# EAGLE design uOsc_2_board_1_v2.0 (EAGLE 9.2.1)
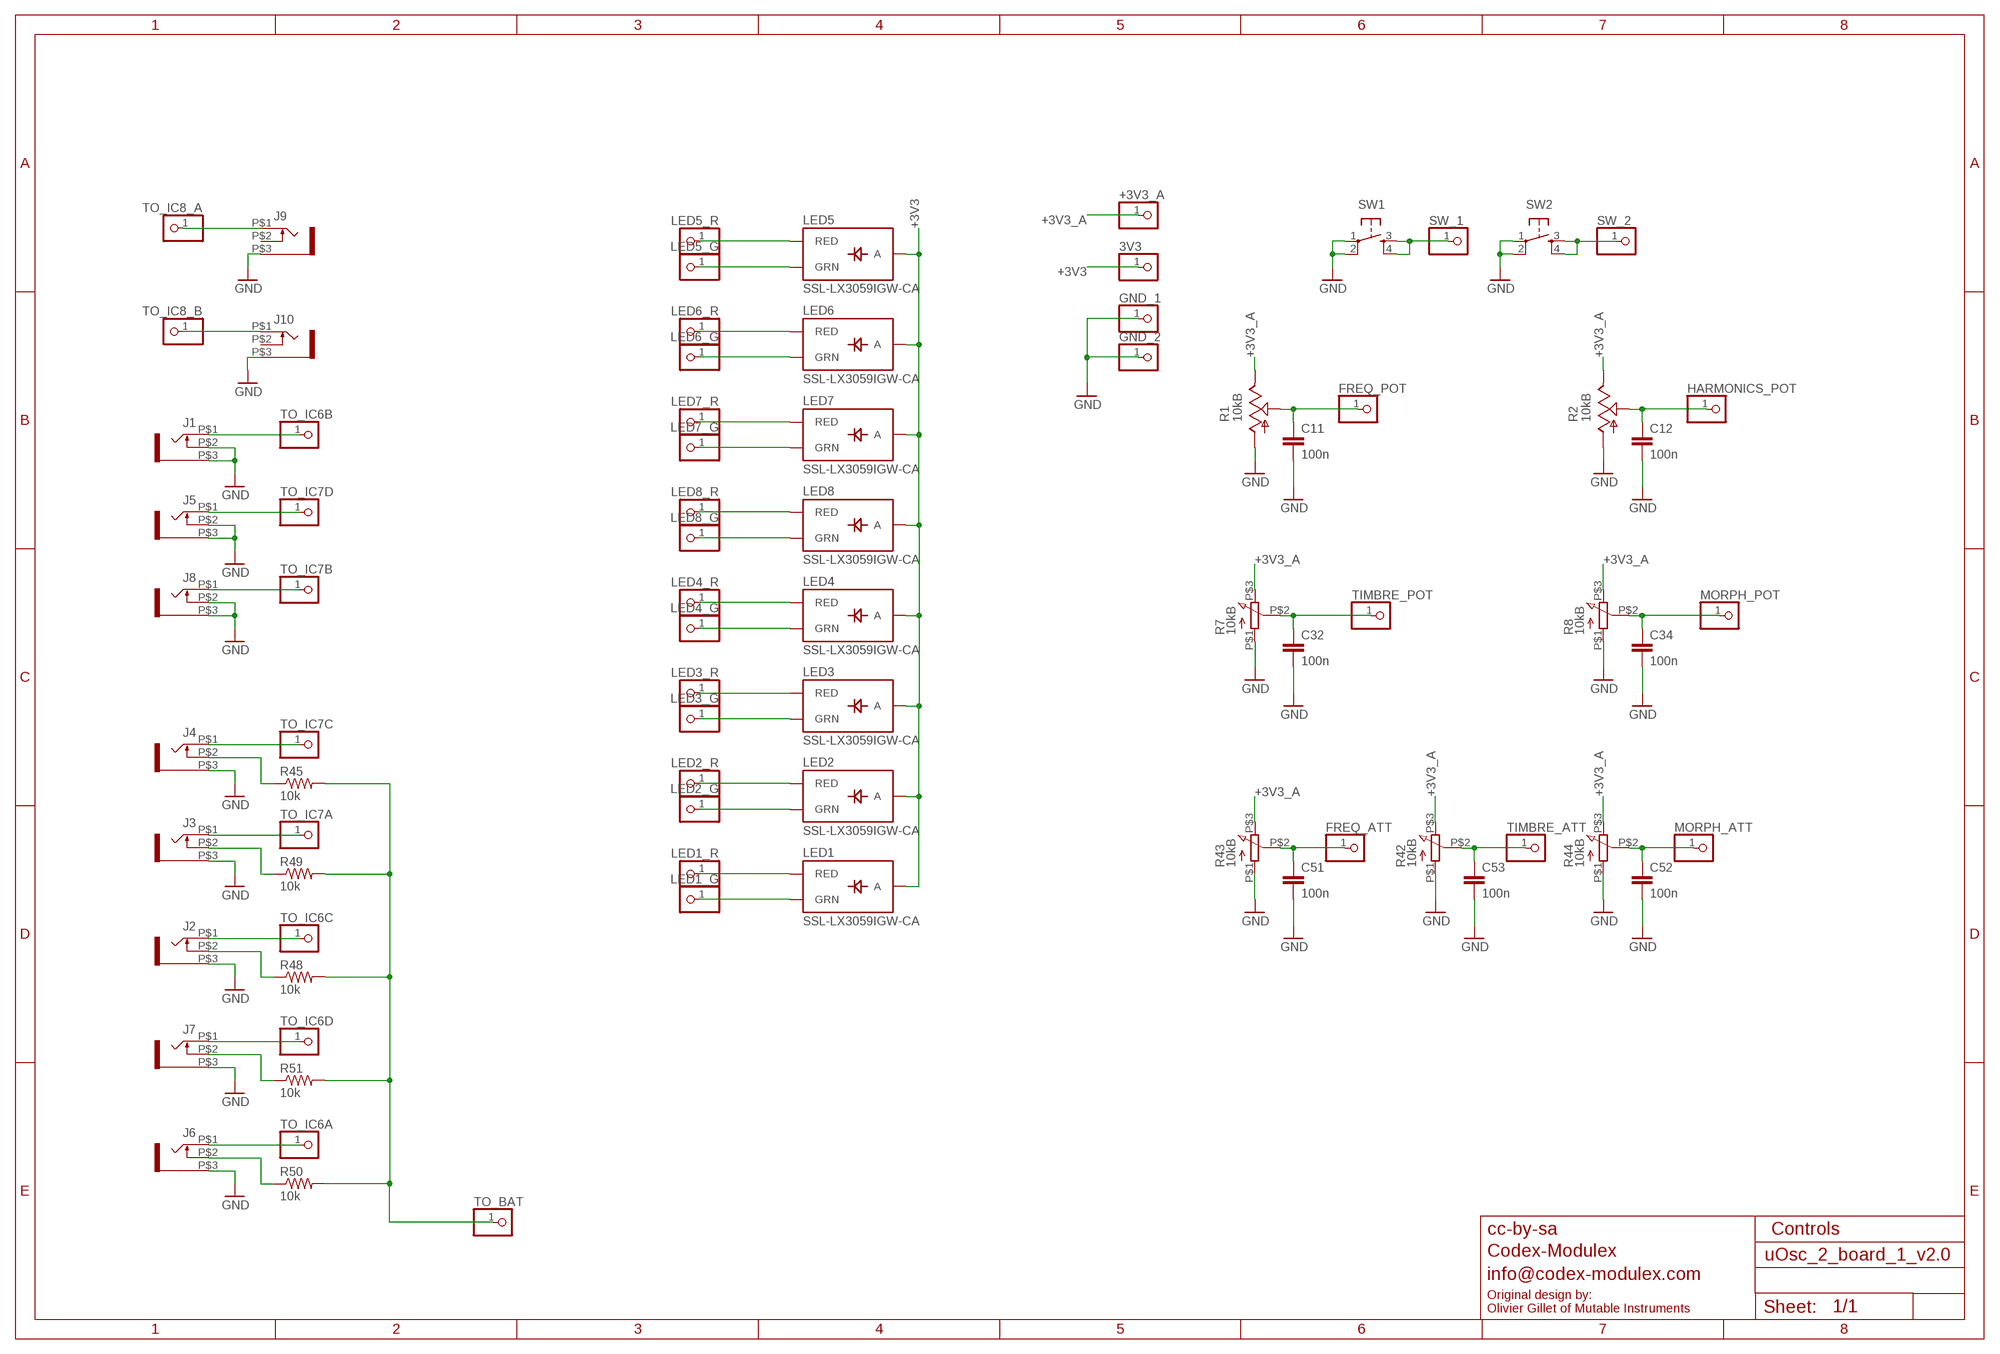
[diagram p0: schematic, sheet 1]

## Parts
3V3  PARTS_AMAN_PINHD-1X1  [PARTS_AMAN_1X01]
+3V3_A  PARTS_AMAN_PINHD-1X1  [PARTS_AMAN_1X01]
C11  100n  PARTS_AMAN_CAPACITOR  [PARTS_AMAN_RESISTOR_0603]
C12  100n  PARTS_AMAN_CAPACITOR  [PARTS_AMAN_RESISTOR_0603]
C32  100n  PARTS_AMAN_CAPACITOR  [PARTS_AMAN_RESISTOR_0603]
C34  100n  PARTS_AMAN_CAPACITOR  [PARTS_AMAN_RESISTOR_0603]
C51  100n  PARTS_AMAN_CAPACITOR  [PARTS_AMAN_RESISTOR_0603]
C52  100n  PARTS_AMAN_CAPACITOR  [PARTS_AMAN_RESISTOR_0603]
C53  100n  PARTS_AMAN_CAPACITOR  [PARTS_AMAN_RESISTOR_0603]
FREQ_ATT  PARTS_AMAN_PINHD-1X1  [PARTS_AMAN_1X01]
FREQ_POT  PARTS_AMAN_PINHD-1X1  [PARTS_AMAN_1X01]
GND_1  PARTS_AMAN_PINHD-1X1  [PARTS_AMAN_1X01]
GND_2  PARTS_AMAN_PINHD-1X1  [PARTS_AMAN_1X01]
HARMONICS_POT  PARTS_AMAN_PINHD-1X1  [PARTS_AMAN_1X01]
J1  WQP-PJ301M-12_JACK  [WQP-PJ301M-12_JACK]
J2  WQP-PJ301M-12_JACK  [WQP-PJ301M-12_JACK]
J3  WQP-PJ301M-12_JACK  [WQP-PJ301M-12_JACK]
J4  WQP-PJ301M-12_JACK  [WQP-PJ301M-12_JACK]
J5  WQP-PJ301M-12_JACK  [WQP-PJ301M-12_JACK]
J6  WQP-PJ301M-12_JACK  [WQP-PJ301M-12_JACK]
J7  WQP-PJ301M-12_JACK  [WQP-PJ301M-12_JACK]
J8  WQP-PJ301M-12_JACK  [WQP-PJ301M-12_JACK]
J9  WQP-PJ301M-12_JACK  [WQP-PJ301M-12_JACK]
J10  WQP-PJ301M-12_JACK  [WQP-PJ301M-12_JACK]
LED1  SSL-LX3059IGW-CA  LED-BICOLOR-THROUGHHOLE-CA  [LED-BICOLOR-THROUGHHOLE-LUMEX]
LED1_G  PARTS_AMAN_PINHD-1X1  [PARTS_AMAN_1X01]
LED1_R  PARTS_AMAN_PINHD-1X1  [PARTS_AMAN_1X01]
LED2  SSL-LX3059IGW-CA  LED-BICOLOR-THROUGHHOLE-CA  [LED-BICOLOR-THROUGHHOLE-LUMEX]
LED2_G  PARTS_AMAN_PINHD-1X1  [PARTS_AMAN_1X01]
LED2_R  PARTS_AMAN_PINHD-1X1  [PARTS_AMAN_1X01]
LED3  SSL-LX3059IGW-CA  LED-BICOLOR-THROUGHHOLE-CA  [LED-BICOLOR-THROUGHHOLE-LUMEX]
LED3_G  PARTS_AMAN_PINHD-1X1  [PARTS_AMAN_1X01]
LED3_R  PARTS_AMAN_PINHD-1X1  [PARTS_AMAN_1X01]
LED4  SSL-LX3059IGW-CA  LED-BICOLOR-THROUGHHOLE-CA  [LED-BICOLOR-THROUGHHOLE-LUMEX]
LED4_G  PARTS_AMAN_PINHD-1X1  [PARTS_AMAN_1X01]
LED4_R  PARTS_AMAN_PINHD-1X1  [PARTS_AMAN_1X01]
LED5  SSL-LX3059IGW-CA  LED-BICOLOR-THROUGHHOLE-CA  [LED-BICOLOR-THROUGHHOLE-LUMEX]
LED5_G  PARTS_AMAN_PINHD-1X1  [PARTS_AMAN_1X01]
LED5_R  PARTS_AMAN_PINHD-1X1  [PARTS_AMAN_1X01]
LED6  SSL-LX3059IGW-CA  LED-BICOLOR-THROUGHHOLE-CA  [LED-BICOLOR-THROUGHHOLE-LUMEX]
LED6_G  PARTS_AMAN_PINHD-1X1  [PARTS_AMAN_1X01]
LED6_R  PARTS_AMAN_PINHD-1X1  [PARTS_AMAN_1X01]
LED7  SSL-LX3059IGW-CA  LED-BICOLOR-THROUGHHOLE-CA  [LED-BICOLOR-THROUGHHOLE-LUMEX]
LED7_G  PARTS_AMAN_PINHD-1X1  [PARTS_AMAN_1X01]
LED7_R  PARTS_AMAN_PINHD-1X1  [PARTS_AMAN_1X01]
LED8  SSL-LX3059IGW-CA  LED-BICOLOR-THROUGHHOLE-CA  [LED-BICOLOR-THROUGHHOLE-LUMEX]
LED8_G  PARTS_AMAN_PINHD-1X1  [PARTS_AMAN_1X01]
LED8_R  PARTS_AMAN_PINHD-1X1  [PARTS_AMAN_1X01]
MORPH_ATT  PARTS_AMAN_PINHD-1X1  [PARTS_AMAN_1X01]
MORPH_POT  PARTS_AMAN_PINHD-1X1  [PARTS_AMAN_1X01]
R1  10kB  POT_USVERTICAL_PS  [ALPS_POT_VERTICAL_PS]
R2  10kB  POT_USVERTICAL_PS  [ALPS_POT_VERTICAL_PS]
R7  10kB  INSTRUO_Q-POT2  [INSTRUO_Q-POT2]
R8  10kB  INSTRUO_Q-POT2  [INSTRUO_Q-POT2]
R42  10kB  INSTRUO_Q-POT2  [INSTRUO_Q-POT2]
R43  10kB  INSTRUO_Q-POT2  [INSTRUO_Q-POT2]
R44  10kB  INSTRUO_Q-POT2  [INSTRUO_Q-POT2]
R45  10k  PARTS_AMAN_RESISTOR  [PARTS_AMAN_RESISTOR_0603]
R48  10k  PARTS_AMAN_RESISTOR  [PARTS_AMAN_RESISTOR_0603]
R49  10k  PARTS_AMAN_RESISTOR  [PARTS_AMAN_RESISTOR_0603]
R50  10k  PARTS_AMAN_RESISTOR  [PARTS_AMAN_RESISTOR_0603]
R51  10k  PARTS_AMAN_RESISTOR  [PARTS_AMAN_RESISTOR_0603]
SW1  TAC_SWITCHPTH  [TACTILE-PTH]
SW2  TAC_SWITCHPTH  [TACTILE-PTH]
SW_1  PARTS_AMAN_PINHD-1X1  [PARTS_AMAN_1X01]
SW_2  PARTS_AMAN_PINHD-1X1  [PARTS_AMAN_1X01]
TIMBRE_ATT  PARTS_AMAN_PINHD-1X1  [PARTS_AMAN_1X01]
TIMBRE_POT  PARTS_AMAN_PINHD-1X1  [PARTS_AMAN_1X01]
TO_BAT  PARTS_AMAN_PINHD-1X1  [PARTS_AMAN_1X01]
TO_IC6A  PARTS_AMAN_PINHD-1X1  [PARTS_AMAN_1X01]
TO_IC6B  PARTS_AMAN_PINHD-1X1  [PARTS_AMAN_1X01]
TO_IC6C  PARTS_AMAN_PINHD-1X1  [PARTS_AMAN_1X01]
TO_IC6D  PARTS_AMAN_PINHD-1X1  [PARTS_AMAN_1X01]
TO_IC7A  PARTS_AMAN_PINHD-1X1  [PARTS_AMAN_1X01]
TO_IC7B  PARTS_AMAN_PINHD-1X1  [PARTS_AMAN_1X01]
TO_IC7C  PARTS_AMAN_PINHD-1X1  [PARTS_AMAN_1X01]
TO_IC7D  PARTS_AMAN_PINHD-1X1  [PARTS_AMAN_1X01]
TO_IC8_A  PARTS_AMAN_PINHD-1X1  [PARTS_AMAN_1X01]
TO_IC8_B  PARTS_AMAN_PINHD-1X1  [PARTS_AMAN_1X01]

## Nets
+3V3: 3V3.1 LED1.A LED2.A LED3.A LED4.A LED5.A LED6.A LED7.A LED8.A
+3V3_A: +3V3_A.1 R1.P$1(E) R2.P$1(E) R7.P$3 R8.P$3 R42.P$3 R43.P$3 R44.P$3
FREQ_ATT: C51.1 FREQ_ATT.1 R43.P$2
FREQ_POT: C11.1 FREQ_POT.1 R1.P$2(S)
GND: C11.2 C12.2 C32.2 C34.2 C51.2 C52.2 C53.2 GND_1.1 GND_2.1 J1.P$2 J1.P$3 J2.P$3 J3.P$3 J4.P$3 J5.P$2 J5.P$3 J6.P$3 J7.P$3 J8.P$2 J8.P$3 J9.P$3 J10.P$3 R1.P$3(A) R2.P$3(A) R7.P$1 R8.P$1 R42.P$1 R43.P$1 R44.P$1 SW1.1 SW1.2 SW2.1 SW2.2
HARMONICS_POT: C12.1 HARMONICS_POT.1 R2.P$2(S)
MORPH_ATT: C52.1 MORPH_ATT.1 R44.P$2
MORPH_POT: C34.1 MORPH_POT.1 R8.P$2
N$1: LED1.GREEN_C(GRN) LED1_G.1
N$2: LED2.GREEN_C(GRN) LED2_G.1
N$5: LED2.RED_C(RED) LED2_R.1
N$6: J4.P$1 TO_IC7C.1
N$7: LED1.RED_C(RED) LED1_R.1
N$8: LED3.RED_C(RED) LED3_R.1
N$9: LED3.GREEN_C(GRN) LED3_G.1
N$10: LED4.RED_C(RED) LED4_R.1
N$11: LED4.GREEN_C(GRN) LED4_G.1
N$12: LED8.RED_C(RED) LED8_R.1
N$13: LED8.GREEN_C(GRN) LED8_G.1
N$14: LED7.RED_C(RED) LED7_R.1
N$15: LED7.GREEN_C(GRN) LED7_G.1
N$16: J1.P$1 TO_IC6B.1
N$17: LED6.RED_C(RED) LED6_R.1
N$18: LED6.GREEN_C(GRN) LED6_G.1
N$19: LED5.RED_C(RED) LED5_R.1
N$20: LED5.GREEN_C(GRN) LED5_G.1
N$21: J9.P$1 TO_IC8_A.1
N$22: J10.P$1 TO_IC8_B.1
N$23: J5.P$1 TO_IC7D.1
N$27: J8.P$1 TO_IC7B.1
N$29: J3.P$1 TO_IC7A.1
N$30: J2.P$1 TO_IC6C.1
N$33: J7.P$1 TO_IC6D.1
N$35: J6.P$1 TO_IC6A.1
N$37: J4.P$2 R45.1
N$38: J3.P$2 R49.1
N$40: J2.P$2 R48.1
N$41: J7.P$2 R51.1
N$42: J6.P$2 R50.1
N$43: R45.2 R48.2 R49.2 R50.2 R51.2 TO_BAT.1
SW_1: SW1.3 SW1.4 SW_1.1
SW_2: SW2.3 SW2.4 SW_2.1
TIMBRE_ATT: C53.1 R42.P$2 TIMBRE_ATT.1
TIMBRE_POT: C32.1 R7.P$2 TIMBRE_POT.1
Unconnected: J9.P$2 J10.P$2

## Notes on the sheet
- cc-by-sa | Controls
- Codex-Modulex
- info@codex-modulex.com
- Original design by:
  Olivier Gillet of Mutable Instruments

## Library data of the parts
3V3 +3V3_A FREQ_ATT FREQ_POT GND_1 GND_2 HARMONICS_POT LED1_G LED1_R LED2_G LED2_R LED3_G LED3_R LED4_G LED4_R LED5_G LED5_R LED6_G LED6_R LED7_G LED7_R LED8_G LED8_R MORPH_ATT MORPH_POT SW_1 SW_2 TIMBRE_ATT TIMBRE_POT TO_BAT TO_IC6A TO_IC6B TO_IC6C TO_IC6D TO_IC7A TO_IC7B TO_IC7C TO_IC7D TO_IC8_A TO_IC8_B = atom_v1_1_board_2:PARTS_AMAN_PINHD-1X1: PIN HEADER
C11 C12 C32 C34 C51-C53 = atom_v1_1_board_2:PARTS_AMAN_CAPACITOR
J1-J10 = thonkiconn:WQP-PJ301M-12_JACK
LED1-LED8 = og-leds:LED-BICOLOR-THROUGHHOLE-CA
R1 R2 = og-pots:POT_US
R7 R8 R42-R44 = uClouds_002_:INSTRUO_Q-POT2
R45 R48-R51 = atom_v1_1_board_2:PARTS_AMAN_RESISTOR
SW1 SW2 = SparkFun:TAC_SWITCH: Momentary Switch Button commonly used for reset or general input. Spark Fun Electronics SKU : COM-00097

## Board
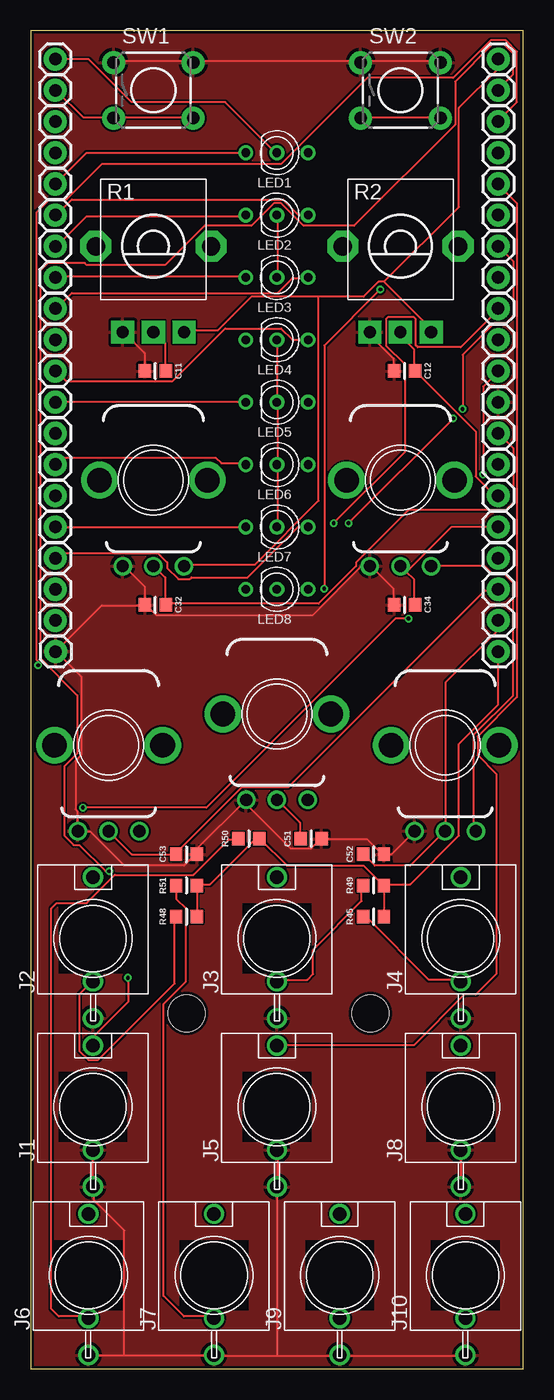
[diagram p1: board, top side]
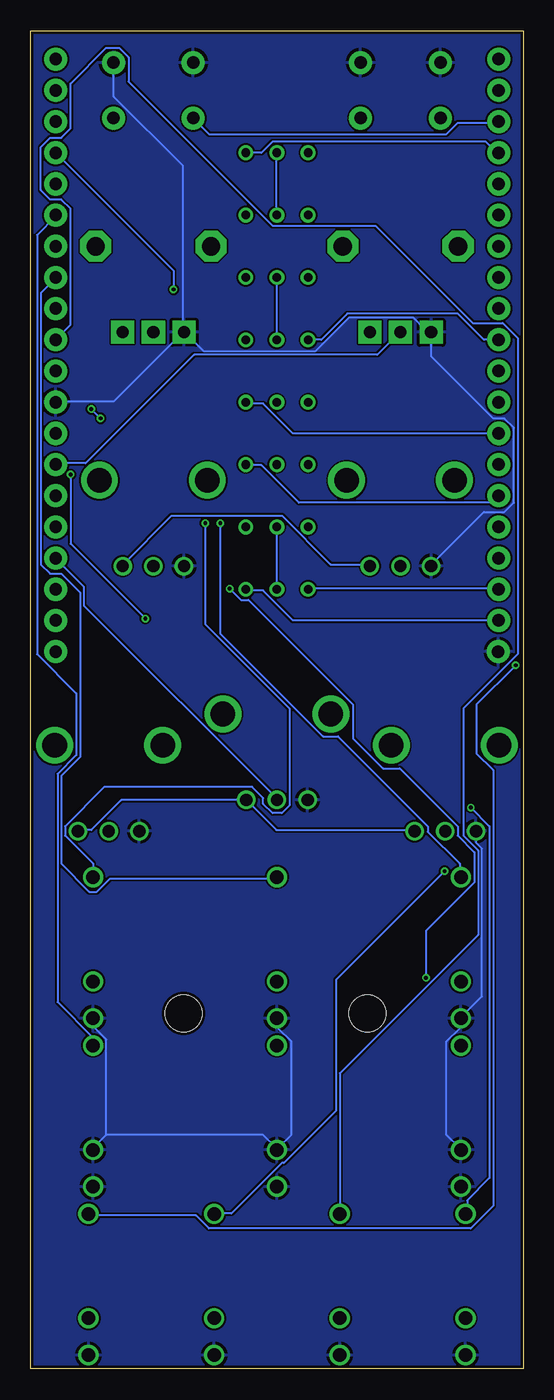
[diagram p2: board, bottom side, seen from below]

Size 40.14 x 109 mm. Coordinates in mm from the lower left corner, seen from the top.
Outline: 0,0 40.14,0 40.14,109 0,109 0,0
Copper layers (1*16): Top 0.035mm / dielectric 1.5mm / Bottom 0.035mm
Design rules "dirt_cheap_dirty_boards.v1.1": minimum track width 6mil, minimum drill 12mil, track to track 6mil, track to pad 6mil, pad to pad 6mil, via to via 6mil, smd to smd 0mil, copper to edge 10mil, drill to drill 10mil, minimum pad ring 10mil, minimum via ring 6mil, stop-mask expansion 2mil, vias tented up to drill 25mil, thermal gap 10mil
Holes 3 mm at 12.7,28.96 27.69,28.96

### Footprints (pad centres in the part's own frame; a part is rotated, then mirrored left to right if it is on the bottom)
PARTS_AMAN_1X01 = drill 1.016 pad 1.88: 1 0,0
PARTS_AMAN_RESISTOR_0603 = smd 1 x 1.1: 1 -0.85,0; 2 0.85,0
WQP-PJ301M-12_JACK = drill 1.1: P$1 0,5; P$2 0,-3.5; P$3 0,-6.5
LED-BICOLOR-THROUGHHOLE-LUMEX = drill 0.7: A 0,0; GREEN_C 2.54,0; RED_C -2.54,0
ALPS_POT_VERTICAL_PS = drill 1 pad 1.88 square: P$1 -2.5,7; P$2 0,7; P$3 2.5,7 | drill 1.5 pad 2.54 octagon: P$4 -4.7,0; P$5 4.7,0
INSTRUO_Q-POT2 = drill 1 pad 1.5: P$1 -2.5,-7; P$2 0,-7; P$3 2.5,-7 | drill 2 pad 2.5: P$4 -4.4,0; P$5 4.4,0
TACTILE-PTH = drill 1.016 pad 1.88: 1 -3.251,2.261; 2 3.251,2.261; 3 -3.251,-2.261; 4 3.251,-2.261

### Placement (x,y rotation side)
3V3  2,106.68 0 top
+3V3_A  38.1,106.68 0 top
C11  10.16,81.28 180 top
C12  30.48,81.28 180 top
C32  10.16,62.23 180 top
C34  30.48,62.23 180 top
C51  22.86,43.18 0 top
C52  27.94,41.91 0 top
C53  12.7,41.91 0 top
FREQ_ATT  38.1,66.04 0 top
FREQ_POT  38.1,73.66 0 top
GND_1  2.03,58.42 0 top
GND_2  38.1,78.74 0 top
HARMONICS_POT  38.1,71.12 0 top
J1  5.08,21.34 0 top
J2  5.08,35.05 0 top
J3  20.07,35.05 0 top
J4  35.05,35.05 0 top
J5  20.07,21.34 0 top
J6  4.7,7.62 0 top
J7  14.94,7.62 0 top
J8  35.05,21.34 0 top
J9  25.19,7.62 0 top
J10  35.43,7.62 0 top
LED1  20.07,99.06 0 top
LED1_G  2,99.06 0 top
LED1_R  2,96.52 0 top
LED2  20.07,93.98 0 top
LED2_G  2,93.98 0 top
LED2_R  2,91.44 0 top
LED3  20.07,88.9 0 top
LED3_G  2,86.36 0 top
LED3_R  2,88.9 0 top
LED4  20.07,83.82 0 top
LED4_G  2,81.28 0 top
LED4_R  2,83.82 0 top
LED5  20.07,78.74 0 top
LED5_G  2,76.2 0 top
LED5_R  2,78.74 0 top
LED6  20.07,73.66 0 top
LED6_G  2,71.12 0 top
LED6_R  2,73.66 0 top
LED7  20.07,68.58 0 top
LED7_G  2,66.04 0 top
LED7_R  2,68.58 0 top
LED8  20.07,63.5 0 top
LED8_G  2,60.96 0 top
LED8_R  2,63.5 0 top
MORPH_ATT  38.1,60.96 0 top
MORPH_POT  38.1,68.58 0 top
R1  10,91.44 180 top
R2  30.14,91.44 180 top
R7  10,72.39 0 top
R8  30.14,72.39 0 top
R42  6.35,50.8 0 top
R43  20.07,53.34 0 top
R44  33.78,50.8 0 top
R45  27.94,36.83 0 top
R48  12.7,36.83 0 top
R49  27.94,39.37 0 top
R50  17.78,43.18 0 top
R51  12.7,39.37 0 top
SW1  10,104.14 0 top
SW2  30.14,104.14 0 top
SW_1  2,104.14 0 top
SW_2  2,101.6 0 top
TIMBRE_ATT  38.1,63.5 0 top
TIMBRE_POT  38.1,76.2 0 top
TO_BAT  38.1,58.42 0 top
TO_IC6A  38.1,81.28 0 top
TO_IC6B  38.1,99.06 0 top
TO_IC6C  38.1,86.36 0 top
TO_IC6D  38.1,83.82 0 top
TO_IC7A  38.1,88.9 0 top
TO_IC7B  38.1,93.98 0 top
TO_IC7C  38.1,91.44 0 top
TO_IC7D  38.1,96.52 0 top
TO_IC8_A  38.1,104.14 0 top
TO_IC8_B  38.1,101.6 0 top

### Tracks (layer width: path | path; a pad name or v marks a point on that pad's centre or on a via)
+3V3
  Top 0.152: LED4.A 20.12,83.82 20.12,78.79 LED5.A 20.12,78.64 20.12,73.76 LED6.A 20.12,73.61 20.12,68.58 LED7.A | LED3.A 20.12,89 20.12,93.88 LED2.A | 3V3.1 2.13,106.68 4.72,106.68 8.23,103.17 15.85,103.17 19.96,99.06 LED1.A
  Bottom 0.152: LED8.A 20.12,63.55 20.12,68.58 LED7.A | LED1.A 20.12,99.06 20.12,94.03 LED2.A | LED4.A 20.12,83.82 20.12,88.85 LED3.A
+3V3_A
  Top 0.152: 23.47,87.33 27.13,87.33 28.35,88.54 28.8,88.54 | 23.47,87.33 17.98,87.33 15.24,84.58 12.65,84.58 R1.P$1 | 28.8,88.54 32.77,84.58 R2.P$1 | +3V3_A.1 38.1,105.92 34.9,102.72 34.9,94.64 28.8,88.54 | R8.P$3 32.77,65.38 37.03,65.38 37.64,64.77 38.56,64.77 39.32,64.01 39.32,54.86 36.12,51.66 36.12,44.04 36.27,43.89 R44.P$3 | 23.47,87.33 23.47,70.71 18.29,65.53 12.65,65.53 R7.P$3
  Bottom 0.152: R7.P$3 12.65,65.53 15.7,65.53 19.66,69.49 28.65,69.49 32.61,65.53 R8.P$3 | R42.P$3 8.99,43.89 20.12,43.89 22.55,46.33 R43.P$3 22.71,46.33 32.77,46.33 35.2,43.89 36.27,43.89 R44.P$3
FREQ_ATT
  Top 0.152: C51.1 21.95,43.28 21.95,44.5 20.12,46.33 R43.P$2
  Bottom 0.152: R43.P$2 20.12,46.48 35.81,62.18 35.81,63.7 38.1,65.99 FREQ_ATT.1
FREQ_POT
  Top 0.152: C11.1 10.97,81.38 10.97,83.52 10.06,84.43 R1.P$2
  Bottom 0.152: FREQ_POT.1 38.1,73.76 35.66,73.76 26.82,82.6 11.89,82.6 10.06,84.43 R1.P$2
GND
  Top 0.152: SW1.1 6.86,106.53 13.11,106.53 SW1.2 13.26,106.53 26.82,106.53 SW2.1 26.98,106.53 33.38,106.53 SW2.2 | C11.2 9.3,81.38 9.3,82.75 7.62,84.43 R1.P$3 | C12.2 29.57,81.38 29.57,82.3 27.74,84.12 27.74,84.43 R2.P$3 | R44.P$1 31.24,43.74 29.41,41.91 28.8,41.91 C52.2 28.65,41.91 27.43,43.13 23.77,43.13 C51.2 23.62,43.13 22.86,42.37 21.18,42.37 17.37,46.18 | 17.37,46.18 17.53,46.33 R43.P$1 17.37,46.18 | 17.37,46.18 13.56,42.37 13.56,41.91 C53.2 13.41,41.91 12.5,41 7.62,41 4.88,43.74 3.96,43.74 R42.P$1 3.81,43.89 3.81,45.41 3.66,45.57 3.66,49.53 4.12,49.99 4.12,56.39 2.13,58.37 GND_1.1 2.13,58.52 5.79,62.18 9.3,62.18 C32.2 | C34.2 29.57,62.33 29.57,63.55 27.74,65.38 R8.P$1 27.58,65.38 26.98,65.38 23.01,61.42 10.21,61.42 9.45,62.18 C32.2 | C32.2 9.3,62.33 9.3,63.7 7.62,65.38 R7.P$1 | J8.P$3 35.05,14.94 J8.P$2 | J5.P$2 20.12,17.83 20.12,14.94 J5.P$3 20.12,14.78 20.12,1.07 | J1.P$2 5.03,17.83 5.03,14.94 J1.P$3 5.18,14.78 5.18,13.72 7.62,11.28 7.62,1.07 | 7.62,1.07 14.94,1.07 J7.P$3 15.09,1.07 20.12,1.07 | 7.62,1.07 4.72,1.07 J6.P$3 | 20.12,1.07 25.15,1.07 J9.P$3 25.3,1.07 35.36,1.07 J10.P$3
  Bottom 0.152: GND_2.1 38.1,78.79 33.38,78.79 27.74,84.43 R2.P$3 | R2.P$3 27.58,84.43 26.06,82.91 16.92,82.91 14.17,85.65 8.99,85.65 7.92,84.58 7.62,84.58 R1.P$3 7.47,84.43 7.47,82.45 2.44,77.42 1.52,77.42 0.76,76.66 0.76,70.56 1.52,69.8 3.2,69.8 7.47,65.53 R7.P$1 | SW2.2 33.38,106.38 33.38,103.63 27.74,97.99 27.74,84.58 R2.P$3 | 33.98,19.05 33.98,26.82 35.05,27.89 35.05,28.5 J4.P$3 | 33.98,19.05 35.05,17.98 J8.P$2 | J3.P$3 19.96,28.5 19.96,27.74 18.9,26.67 18.9,19.05 19.96,17.98 J5.P$2 20.12,17.98 21.18,19.05 33.98,19.05 | J1.P$2 5.18,17.98 6.25,19.05 6.25,26.67 5.18,27.74 5.18,28.5 J2.P$3 5.03,28.65 3.35,30.33 3.35,42.37 3.81,42.82 3.81,43.74 R42.P$1
  pour Top (isolate 0.012): 0,109.22 40.64,109.22 40.64,0 0,0
  pour Bottom (isolate 0.012): 0,109.22 40.64,109.22 40.64,0 0,0
HARMONICS_POT
  Top 0.152: R2.P$2 30.18,84.43 30.18,84.12 31.24,83.06 31.24,81.38 C12.1 31.39,81.23 36.27,76.35 36.27,72.69 37.8,71.17 38.1,71.17 HARMONICS_POT.1
MORPH_ATT
  Top 0.152: C52.1 27.13,41.91 28.04,41 30.94,41 33.68,43.74 R44.P$2 33.83,43.89 33.83,55.93 38.1,60.2 MORPH_ATT.1
MORPH_POT
  Top 0.152: 30.63,64.92 30.18,65.38 R8.P$2 30.63,64.92 | 30.63,64.92 31.24,64.31 31.24,62.33 C34.1 | 30.63,64.92 34.29,68.58 MORPH_POT.1
N$1
  Bottom 0.152: LED1.GREEN_C 22.55,99.06 21.34,99.06 20.42,99.97 3.05,99.97 2.13,99.06 LED1_G.1
N$2
  Top 0.152: LED2.GREEN_C 22.55,94.03 21.79,94.03 20.57,95.25 3.35,95.25 2.13,94.03 LED2_G.1
N$5
  Top 0.152: LED2.RED_C 17.53,93.88 4.57,93.88 2.13,91.44 LED2_R.1
N$6  (via drill 0.3)
  Top 0.152: v34.44,77.42 v25.91,68.89 | v35.2,78.18 35.2,82.6 37.8,85.19 38.71,85.19 39.32,85.8 39.32,90.22 TO_IC7C.1
  Bottom 0.152: v25.91,68.89 25.91,60.66 19.05,53.8 19.05,45.87 19.66,45.26 20.42,45.26 21.18,46.02 21.18,46.48 22.1,47.4 34.14,47.4 37.34,44.2 37.34,43.43 35.05,41.15 35.05,40.08 J4.P$1 | v35.2,78.18 v34.44,77.42
N$7
  Top 0.152: LED1.RED_C 4.57,99.06 2.13,96.62 LED1_R.1
N$8
  Top 0.152: LED3.RED_C 17.53,89 2.13,89 LED3_R.1
N$9
  Top 0.152: LED3.GREEN_C 22.55,88.85 21.34,88.85 20.12,87.63 3.35,87.63 2.13,86.41 LED3_G.1
N$10
  Bottom 0.152: LED4.RED_C 16.46,83.82 14.33,85.95 5.33,85.95 3.2,83.82 2.13,83.82 LED4_R.1
N$11
  Top 0.152: LED4.GREEN_C 22.55,83.82 21.34,83.82 20.42,84.73 15.85,84.73 11.58,80.47 2.9,80.47 2.13,81.23 LED4_G.1
N$12
  Bottom 0.152: LED8.RED_C 17.53,63.55 2.13,63.55 LED8_R.1
N$13
  Bottom 0.152: LED8.GREEN_C 22.55,63.4 21.18,63.4 18.75,60.96 2.13,60.96 LED8_G.1
N$14
  Top 0.152: LED7.RED_C 2.13,68.58 LED7_R.1
N$15
  Top 0.152: LED7.GREEN_C 22.55,68.58 21.79,68.58 17.68,64.47 13.11,64.47 12.95,64.31 12.04,64.31 11.12,65.23 11.12,65.68 10.36,66.45 2.44,66.45 2.13,66.14 LED7_G.1
N$16  (via drill 0.3)
  Top 0.152: v7.92,31.85 7.92,29.87 5.18,27.13 5.18,26.36 J1.P$1 | v23.93,63.55 23.93,83.36 v28.5,87.94
  Bottom 0.152: v7.92,31.85 7.92,35.66 3.96,39.62 3.96,42.06 5.33,43.43 5.33,44.2 10.06,48.92 11.43,48.92 13.87,51.36 13.87,54.1 22.4,62.64 23.01,62.64 v23.93,63.55 | v28.5,87.94 28.5,89.46 TO_IC6B.1
N$17
  Top 0.152: LED6.RED_C 17.53,73.76 15.54,73.76 15.09,74.22 2.59,74.22 2.13,73.76 LED6_R.1
N$18
  Bottom 0.152: LED6.GREEN_C 22.55,73.61 21.34,73.61 18.29,70.56 2.59,70.56 2.13,71.02 LED6_G.1
N$19
  Top 0.152: LED5.RED_C 17.53,78.79 2.13,78.79 LED5_R.1
N$20
  Bottom 0.152: LED5.GREEN_C 22.55,78.64 21.18,78.64 18.75,76.2 2.13,76.2 LED5_G.1
N$21  (via drill 0.3)
  Top 0.152: v6.4,40.54 6.1,40.54 3.96,42.67 3.5,42.67 2.74,43.43 2.74,49.07 3.81,50.14 3.81,54.86 0.76,57.91 0.76,89.46 1.37,90.07 4.42,90.07 4.57,89.92 10.97,89.92 14.17,93.12 17.98,93.12 19.81,94.94 20.42,94.94 22.25,93.12 26.36,93.12 34.59,101.35 34.59,104.85 37.64,107.9 38.56,107.9 39.32,107.14 39.32,105.46 38.1,104.24 TO_IC8_A.1
  Bottom 0.152: v6.4,40.54 15.24,31.7 15.24,21.03 19.51,16.76 19.66,16.76 23.77,12.65 25.15,12.65 J9.P$1
N$22  (via drill 0.3)
  Top 0.152: v0.61,57.3 0.61,57.61 0.46,57.76 0.46,94.18 1.52,95.25 2.9,95.25 5.79,98.15 20.42,98.15 27.43,105.16 34.44,105.16 37.49,108.2 38.71,108.2 39.62,107.29 39.62,103.17 38.1,101.65 TO_IC8_B.1
  Bottom 0.152: v0.61,57.3 3.81,54.1 3.81,50.14 2.44,48.77 2.44,13.26 4.27,11.43 25.6,11.43 26.67,12.5 35.36,12.5 J10.P$1
N$23
  Top 0.152: J5.P$1 20.12,26.36 31.24,26.36 35.36,30.48 36.27,30.48 37.95,32.16 37.95,48.46 36.42,49.99 36.42,51.51 39.62,54.71 39.62,94.94 38.1,96.47 TO_IC7D.1
N$27
  Bottom 0.152: J8.P$1 35.05,26.36 35.05,26.98 37.95,29.87 37.95,48.46 36.42,49.99 36.42,55.02 39.62,58.22 39.62,92.35 38.1,93.88 TO_IC7B.1
N$29
  Bottom 0.152: J3.P$1 20.12,39.93 33.68,39.93 34.75,38.86 35.36,38.86 37.64,41.15 37.64,48.31 36.12,49.84 36.12,63.25 37.64,64.77 38.56,64.77 39.32,65.53 39.32,87.63 38.1,88.85 TO_IC7A.1
N$30  (via drill 0.3)
  Top 0.152: v24.69,68.89 30.48,74.68 30.48,81.84 28.96,83.36 28.96,85.5 29.11,85.65 31.24,85.65 31.39,85.5 31.39,83.36 31.55,83.21 35.05,83.21 38.1,86.26 TO_IC6C.1
  Bottom 0.152: v24.69,68.89 24.69,59.89 16.31,51.51 15.09,51.51 7.77,44.2 7.77,43.74 5.18,41.15 5.18,40.08 J2.P$1
N$33
  Bottom 0.152: TO_IC6D.1 36.88,85.04 36.88,94.49 37.64,95.25 38.56,95.25 39.32,96.01 39.32,99.52 38.56,100.28 37.64,100.28 36.88,101.04 36.88,104.7 33.98,107.59 32.92,107.59 32.16,106.83 32.16,104.85 20.42,93.12 12.04,93.12 4.12,85.19 1.68,85.19 0.46,83.97 0.46,58.22 4.88,53.8 4.88,43.43 3.66,42.22 3.66,35.36 14.94,24.08 14.94,12.65 J7.P$1
N$35  (via drill 0.3)
  Top 0.152: v4.27,45.72 14.33,45.72 29.72,61.11 v30.79,61.11 | v36.88,72.85 36.88,80.01 38.1,81.23 TO_IC6A.1
  Bottom 0.152: v4.27,45.72 2.74,44.2 2.74,15.54 4.57,13.72 4.57,12.65 J6.P$1 | v30.79,61.11 36.88,67.21 v36.88,72.85
N$37
  Top 0.152: R45.1 27.13,36.73 27.43,36.73 32.46,31.7 35.05,31.7 J4.P$2
N$38
  Top 0.152: R49.1 26.98,39.32 26.98,38.1 23.01,34.14 23.01,32.16 22.55,31.7 20.12,31.7 J3.P$2
N$40
  Top 0.152: R48.1 11.73,36.73 11.73,31.39 5.49,25.15 4.72,25.15 3.96,25.91 3.96,30.48 5.03,31.55 J2.P$2
N$41
  Top 0.152: R51.1 11.89,39.32 11.89,38.25 12.65,37.49 12.65,31.55 10.82,29.72 10.82,5.94 12.5,4.27 14.94,4.27 J7.P$2
N$42
  Top 0.152: R50.1 16.92,43.13 16.15,43.13 13.26,40.23 6.86,40.23 4.57,37.95 2.13,37.95 1.68,37.49 1.68,4.88 2.29,4.27 4.57,4.27 J6.P$2
N$43
  Top 0.152: R45.2 28.8,36.88 28.8,39.32 R49.2 | R48.2 13.56,36.88 13.56,39.32 R51.2 13.56,39.47 14.63,39.47 18.29,43.13 18.59,43.13 R50.2 18.75,43.13 20.88,41 27.13,41 28.65,39.47 R49.2 | TO_BAT.1 38.1,58.37 38.1,54.1 34.9,50.9 34.9,43.43 30.94,39.47 28.8,39.47 R49.2
SW_1
  Top 0.152: SW_1.1 2.13,104.09 4.27,101.96 6.71,101.96 SW1.3 6.86,101.96 13.11,101.96 SW1.4
SW_2
  Top 0.152: SW2.4 33.38,101.96 26.98,101.96 SW2.3
  Bottom 0.152: SW_2.1 2.13,101.5 5.33,101.5 6.25,100.58 25.6,100.58 26.82,101.8 SW2.3
TIMBRE_ATT
  Top 0.152: 11.73,41.91 8.23,41.91 6.4,43.74 R42.P$2 | 11.73,41.91 C53.1 11.73,41.91 | 11.73,41.91 17.22,47.4 21.03,47.4 37.03,63.4 38.1,63.4 TIMBRE_ATT.1
TIMBRE_POT
  Top 0.152: R7.P$2 10.06,65.38 10.97,64.47 10.97,62.33 C32.1 11.12,62.33 23.47,62.33 26.52,65.38 26.52,65.68 30.79,69.95 38.71,69.95 39.32,70.56 39.32,74.98 TIMBRE_POT.1